# Altium schematic sheet isoDebug-FTDI.SchDoc
size A4; Organization: UltraZohm; SheetNumber: 32; SheetTotal: 40
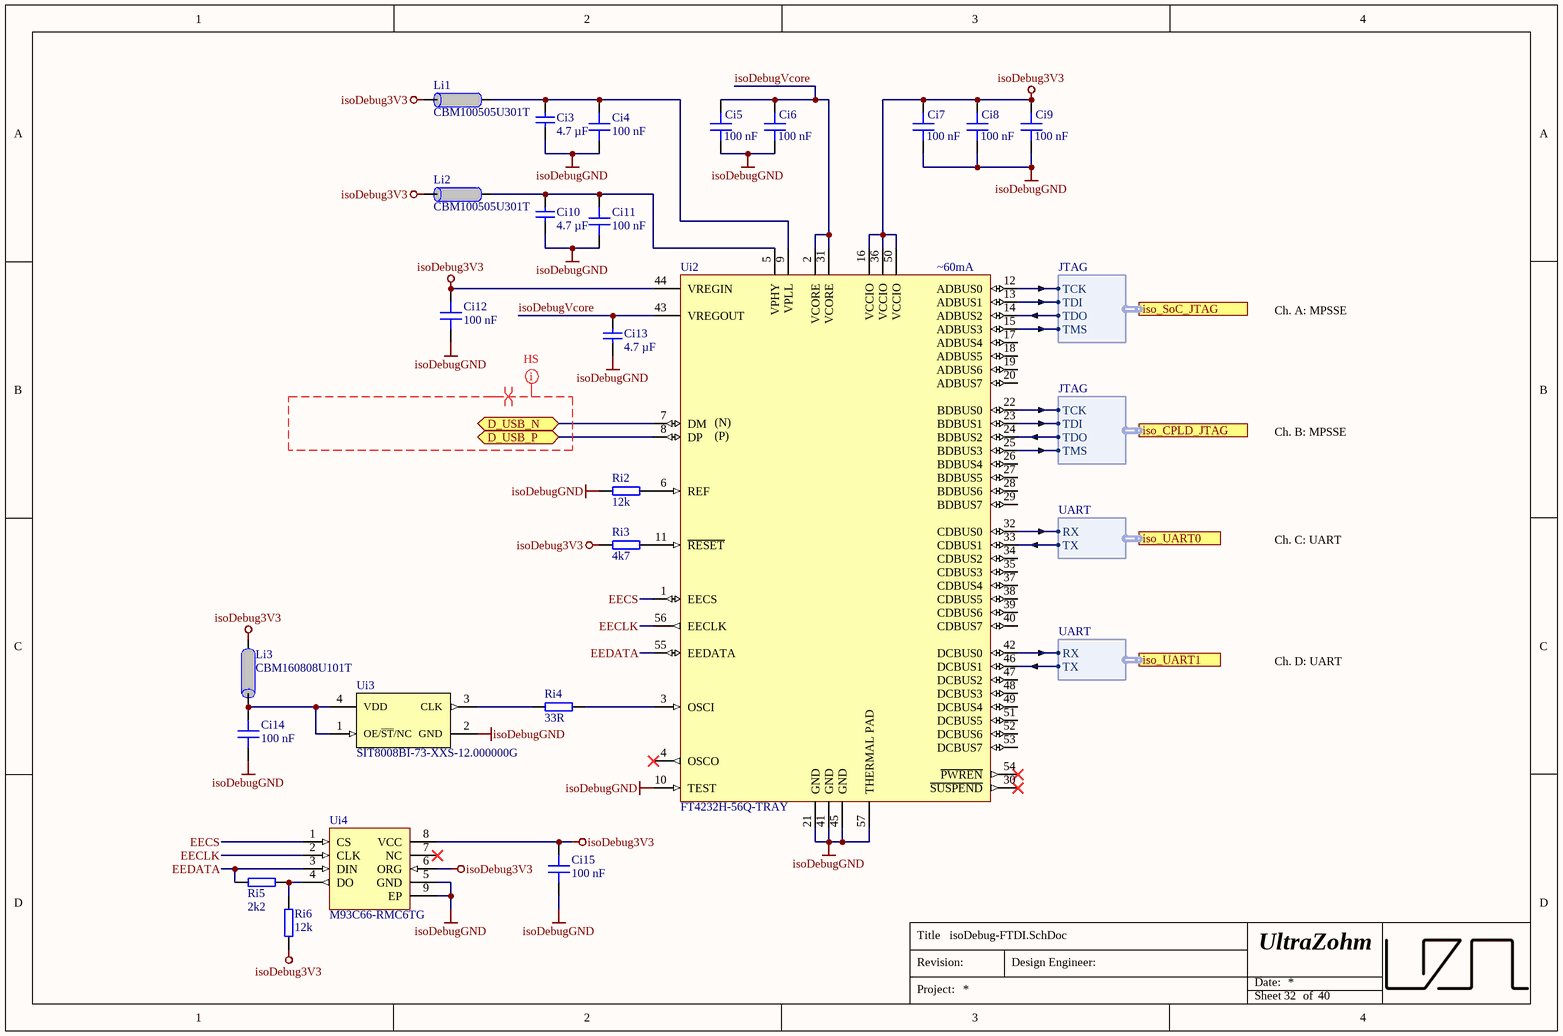
[diagram p0: isoDebug-FTDI.SchDoc]

## Parts
Ci3  4.7 µF  [C_0603_TE]
Ci4  100 nF  [C_0402_TE]
Ci5  100 nF  [C_0402_TE]
Ci6  100 nF  [C_0402_TE]
Ci7  100 nF  [C_0402_TE]
Ci8  100 nF  [C_0402_TE]
Ci9  100 nF  [C_0402_TE]
Ci10  4.7 µF  [C_0603_TE]
Ci11  100 nF  [C_0402_TE]
Ci12  100 nF  [C_0402_TE]
Ci13  4.7 µF  [C_0603_TE]
Ci14  100 nF  [C_0402_TE]
Ci15  100 nF  [C_0402_TE]
Li1  CBM100505U301T  [IND_0402_TE]
Li2  CBM100505U301T  [IND_0402_TE]
Li3  CBM160808U101T  [IND_0603_TE]
Ri2  12k  [R_0603_TE]
Ri3  4k7  [R_0603_TE]
Ri4  33R  [R_0603_TE]
Ri5  2k2  [R_0603_TE]
Ri6  12k  [R_0603_TE]
Ui2  FT4232H-56Q-TRAY  [QFN50P800X800-57T610X610N]
Ui3  SIT8008BI-73-XXS-12.000000G  [2016]
Ui4  M93C66-RMC6TG  [UFDFPN8]

## Ports
D_USB_N (bidir), D_USB_P (bidir), iso_CPLD_JTAG (harness JTAG), iso_SoC_JTAG (harness JTAG), iso_UART0 (harness UART), iso_UART1 (harness UART)

## Harnesses
JTAG: TCK, TDI, TDO, TMS
UART: RX, TX

## Nets
isoDebug3V3: Ci7.2 Ci8.2 Ci9.2 Ci12.2 Ci15.2 Li1.2 Li2.2 Li3.1 Ri3.1 Ri6.1 Ui2.16(VCCIO) Ui2.36(VCCIO) Ui2.44(VREGIN) Ui2.50(VCCIO) Ui4.6(ORG) Ui4.8(VCC)
isoDebugGND: Ci3.1 Ci4.1 Ci5.1 Ci6.1 Ci7.1 Ci8.1 Ci9.1 Ci10.1 Ci11.1 Ci12.1 Ci13.1 Ci14.1 Ci15.1 Ri2.1 Ui2.10(TEST) Ui2.21(GND) Ui2.41(GND) Ui2.45(GND) Ui2.57(THERMAL_PAD) Ui3.2(GND) Ui4.5(GND) Ui4.9(EP)
D_USB_N: Ui2.7(DM) ; port D_USB_N
D_USB_P: Ui2.8(DP) ; port D_USB_P
EECLK: Ui2.56(EECLK) Ui4.2(CLK)
EECS: Ui2.1(EECS) Ui4.1(CS)
EEDATA: Ri5.1 Ui2.55(EEDATA) Ui4.3(DIN)
isoDebugVcore: Ci5.2 Ci6.2 Ci13.2 Ui2.2(VCORE) Ui2.31(VCORE) Ui2.43(VREGOUT)
NetCi3_2: Ci3.2 Ci4.2 Li1.1 Ui2.9(VPLL)
NetCi10_2: Ci10.2 Ci11.2 Li2.1 Ui2.5(VPHY)
NetCi14_2: Ci14.2 Li3.2 Ui3.1(OE/~{ST}/NC) Ui3.4(VDD)
NetRi2_2: Ri2.2 Ui2.6(REF)
NetRi3_2: Ri3.2 Ui2.11(~{RESET})
NetRi4_1: Ri4.1 Ui3.3(CLK)
NetRi4_2: Ri4.2 Ui2.3(OSCI)
NetRi5_2: Ri5.2 Ri6.2 Ui4.4(DO)
NetUi2_12: Ui2.12(ADBUS0) ; port iso_SoC_JTAG.TCK
NetUi2_13: Ui2.13(ADBUS1) ; port iso_SoC_JTAG.TDI
NetUi2_14: Ui2.14(ADBUS2) ; port iso_SoC_JTAG.TDO
NetUi2_15: Ui2.15(ADBUS3) ; port iso_SoC_JTAG.TMS
NetUi2_22: Ui2.22(BDBUS0) ; port iso_CPLD_JTAG.TCK
NetUi2_23: Ui2.23(BDBUS1) ; port iso_CPLD_JTAG.TDI
NetUi2_24: Ui2.24(BDBUS2) ; port iso_CPLD_JTAG.TDO
NetUi2_25: Ui2.25(BDBUS3) ; port iso_CPLD_JTAG.TMS
NetUi2_32: Ui2.32(CDBUS0) ; port iso_UART0.RX
NetUi2_33: Ui2.33(CDBUS1) ; port iso_UART0.TX
NetUi2_42: Ui2.42(DCBUS0) ; port iso_UART1.RX
NetUi2_46: Ui2.46(DCBUS1) ; port iso_UART1.TX

Not connected (* = marked no-connect by the designer): Ui2 4(OSCO)* 17(ADBUS4) 18(ADBUS5) 19(ADBUS6) 20(ADBUS7) 26(BDBUS4) 27(BDBUS5) 28(BDBUS6) 29(BDBUS7) 30(~{SUSPEND})* 34(CDBUS2) 35(CDBUS3) 37(CDBUS4) 38(CDBUS5) 39(CDBUS6) 40(CDBUS7) 47(DCBUS2) 48(DCBUS3) 49(DCBUS4) 51(DCBUS5) 52(DCBUS6) 53(DCBUS7) 54(~{PWREN})*; Ui4 7(NC)*

## Layout directives
differential pair: (no net found under the mark)
net class HS: (no net found under the mark)

## Notes on the sheet
- (near Ui2) ~60mA
- Ch. A: MPSSE
- Ch. B: MPSSE
- Ch. C: UART
- Ch. D: UART
- Title
- Revision:
- Design Engineer:
- Date:
- Project:
- Sheet
- of
- (in symbol FT4232H-56Q-TRAY) (N); (P)

## Library data of the parts
Ci3 Ci10 Ci13 = UZgen_C_0603_4.7uF_16V_X5R: Generic capacitor; Manufacturer: UZgen; Tolerance: 10 %; Created from: MGeier; Voltage: 16V; Manufacturer Part Number: UZgen_C_0603_4.7uF_16V_X5R; PartID: 5809; Created On: 20/03/2025 14:43:45; Device Package: 0603; Last Updated: 20/03/2025 14:43:45; Mounting Type: SMD; Value: 4.7 µF; Technology: X5R
Ci4-Ci9 Ci11 Ci12 Ci14 Ci15 = GRM155R71H104KE14D: 50V 100nF X7R ±10% 0402 Multilayer Ceramic Capacitors MLCC - SMD/SMT ROHS; Manufacturer: Murata Electronics; Voltage Rating: 50 VDC; Created from: AGeiger; Manufacturer Part Number: GRM155R71H104KE14D; PartID: 144; Created On: 13.12.2023 22:03:54; ComponentLink1Description: Datasheet; ComponentLink1URL: https://datasheet.lcsc.com/lcsc/1809272047_Murata-Electronics-GRM155R71H104KE14D_C77020.pdf; Component Type: Capacitor 0402; Device Package: 0402; Last Updated: 13.12.2023 22:03:54; Mounting Type: SMD; Operating Temperature: -55 to +125°C; Series: X7R; Supplier 1: LCSC; Supplier Part Number 1: C77020; Type: Capacitor; Tolerance: 10 %; Value: 100 nF; Live Cycle Status: 1; LCSC Part Number: C77020
Li1 Li2 = CBM100505U301T: 300mΩ ±25% 300Ω@100MHz 0402 Ferrite Beads ROHS; Manufacturer: FH (Guangdong Fenghua Advanced Tech); DC current: 0.6 A; Value: 300 mOhm; Created from: AGeiger; Manufacturer Part Number: CBM100505U301T; PartID: 20; Created On: 13.12.2023 22:24:41; ComponentLink1Description: Datasheet; ComponentLink1URL: https://datasheet.lcsc.com/lcsc/2304140030_FH--Guangdong-Fenghua-Advanced-Tech-CBM100505U301T_C394406.pdf; Component Type: Ferrite Beads; Device Package: 0402; Last Updated: 13.12.2023 22:24:41; Mounting Type: SMD; Operating Temperature: -40 to +85°C; Supplier 1: LCSC; Supplier Part Number 1: C394406; Type: Ferrite Bead; Live Cycle Status: 1; LCSC Part Number: C394406
Li3 = CBM160808U101T: 60mΩ ±25% 100Ω@100MHz 0603 Ferrite Beads ROHS; Manufacturer: FH (Guangdong Fenghua Advanced Tech); DC current: 2.5 A; Value: 60 mOhm; Created from: AGeiger; Manufacturer Part Number: CBM160808U101T; PartID: 21; Created On: 13.12.2023 22:36:14; ComponentLink1Description: Datasheet; ComponentLink1URL: https://datasheet.lcsc.com/lcsc/1912111437_FH--Guangdong-Fenghua-Advanced-Tech-CBM160808U101T_C361675.pdf; Component Type: Ferrite Beads; Device Package: 0603; Last Updated: 13.12.2023 22:36:14; Mounting Type: SMD; Operating Temperature: -40 to +85°C; Supplier 1: LCSC; Supplier Part Number 1: C361675; Type: Ferrite Bead; Live Cycle Status: 1; LCSC Part Number: C361675
Ri2 Ri6 = UZgen_R_0603_12k: Generic resistor; Manufacturer: UZgen; Tolerance: 1 %; Created from: UZgenTool; Manufacturer Part Number: UZgen_R_0603_12k; PartID: 246; Created On: 02/07/2024 17:29:50; Device Package: 0603; Last Updated: 02/07/2024 17:29:50; Mounting Type: SMD; Value: 12k
Ri3 = UZgen_R_0603_4k7: Generic resistor; Manufacturer: UZgen; Tolerance: 1 %; Created from: UZgenTool; Manufacturer Part Number: UZgen_R_0603_4k7; PartID: 237; Created On: 02/07/2024 17:29:50; Device Package: 0603; Last Updated: 02/07/2024 17:29:50; Mounting Type: SMD; Value: 4k7
Ri4 = UZgen_R_0603_33R: Generic resistor; Manufacturer: UZgen; Tolerance: 1 %; Created from: UZgenTool; Manufacturer Part Number: UZgen_R_0603_33R; PartID: 185; Created On: 02/07/2024 17:29:48; Device Package: 0603; Last Updated: 02/07/2024 17:29:48; Mounting Type: SMD; Value: 33R
Ri5 = UZgen_R_0603_2k2: Generic resistor; Manufacturer: UZgen; Tolerance: 1 %; Created from: UZgenTool; Manufacturer Part Number: UZgen_R_0603_2k2; PartID: 229; Created On: 02/07/2024 17:29:49; Device Package: 0603; Last Updated: 02/07/2024 17:29:49; Mounting Type: SMD; Value: 2k2
Ui2 = FT4232H-56Q-TRAY: USB Interface IC Quad 480Mbs 4 UART USB 2.0 12Mbit; Manufacturer: FTDI; Created from: AGeiger; PartID: 1; Created On: 26.11.2023 16:58:07; ComponentLink1Description: Datasheet; ComponentLink1URL: https://www.mouser.de/datasheet/2/163/DS_FT4232H-1621254.pdf; Component Type: USB Controller; Device Package: VQFN-56; Last Updated: 26.11.2023 16:58:07; Manufacturer Part Number: FT4232H-56Q-TRAY; Mounting Type: SMD; Operating Temperature: -40 to 85 °C; Series: FT4232H; Supplier 1: Mouser; Supplier Part Number 1: 895-FT4232H-56Q-TRAY; Value: FT4232H-56Q-TRAY; LCSC Part Number: C1521561
Ui3 = SIT8008BI-73-XXS-12.000000G: Clock-Standardoszillatoren -40 to 85C, 2016, 50ppm, 2.25V-3.63V, 12MHz, ST, 250 pcs T&R 8 mm; Manufacturer: SiTime; Created from: AGeiger; Manufacturer Part Number: SIT8008BI-73-XXS-12.000000G; PartID: 2; Created On: 11.01.2024 17:02:48; ComponentLink1Description: Datasheet; ComponentLink1URL: https://www.mouser.de/datasheet/2/371/SiT8008B_datasheet-1291019.pdf; Component Type: Oscillator; Device Package: 2016; Last Updated: 11.01.2024 17:02:48; Mounting Type: SMD; Operating Temperature: -40 to +85 °C; Supplier 1: Mouser; Supplier Part Number 1: 788-8008BI73XXS120G; Value: 12 MHz; LCSC Part Number: C1508636
Ui4 = M93C66-RMC6TG: 4Kbit MICROWIRE EE 1.8 V to 5.5 V; Manufacturer: STMicroelectronics; Created from: AGeiger; Manufacturer Part Number: M93C66-RMC6TG; PartID: 2; Created On: 19.11.2023 15:06:30; ComponentLink1Description: Datasheet; ComponentLink1URL: https://www.mouser.de/datasheet/2/389/m93c46_w-1849748.pdf; Component Type: EEPROM; Device Package: UFDFPN-8; Last Updated: 19.11.2023 21:39:04; Mounting Type: SMD; Operating Temperature: -40 to +85 °C; Series: M93xxx; Supplier 1: Mouser; Supplier Part Number 1: 511-M93C66-RMC6TG; Supplier 2: LCSC; Supplier Part Number 2: C2061956; Type: Memory; Value: M93C66-RMC6TG; LCSC Part Number: C2061956